# Altium schematic sheet rs232_part.SchDoc
size B
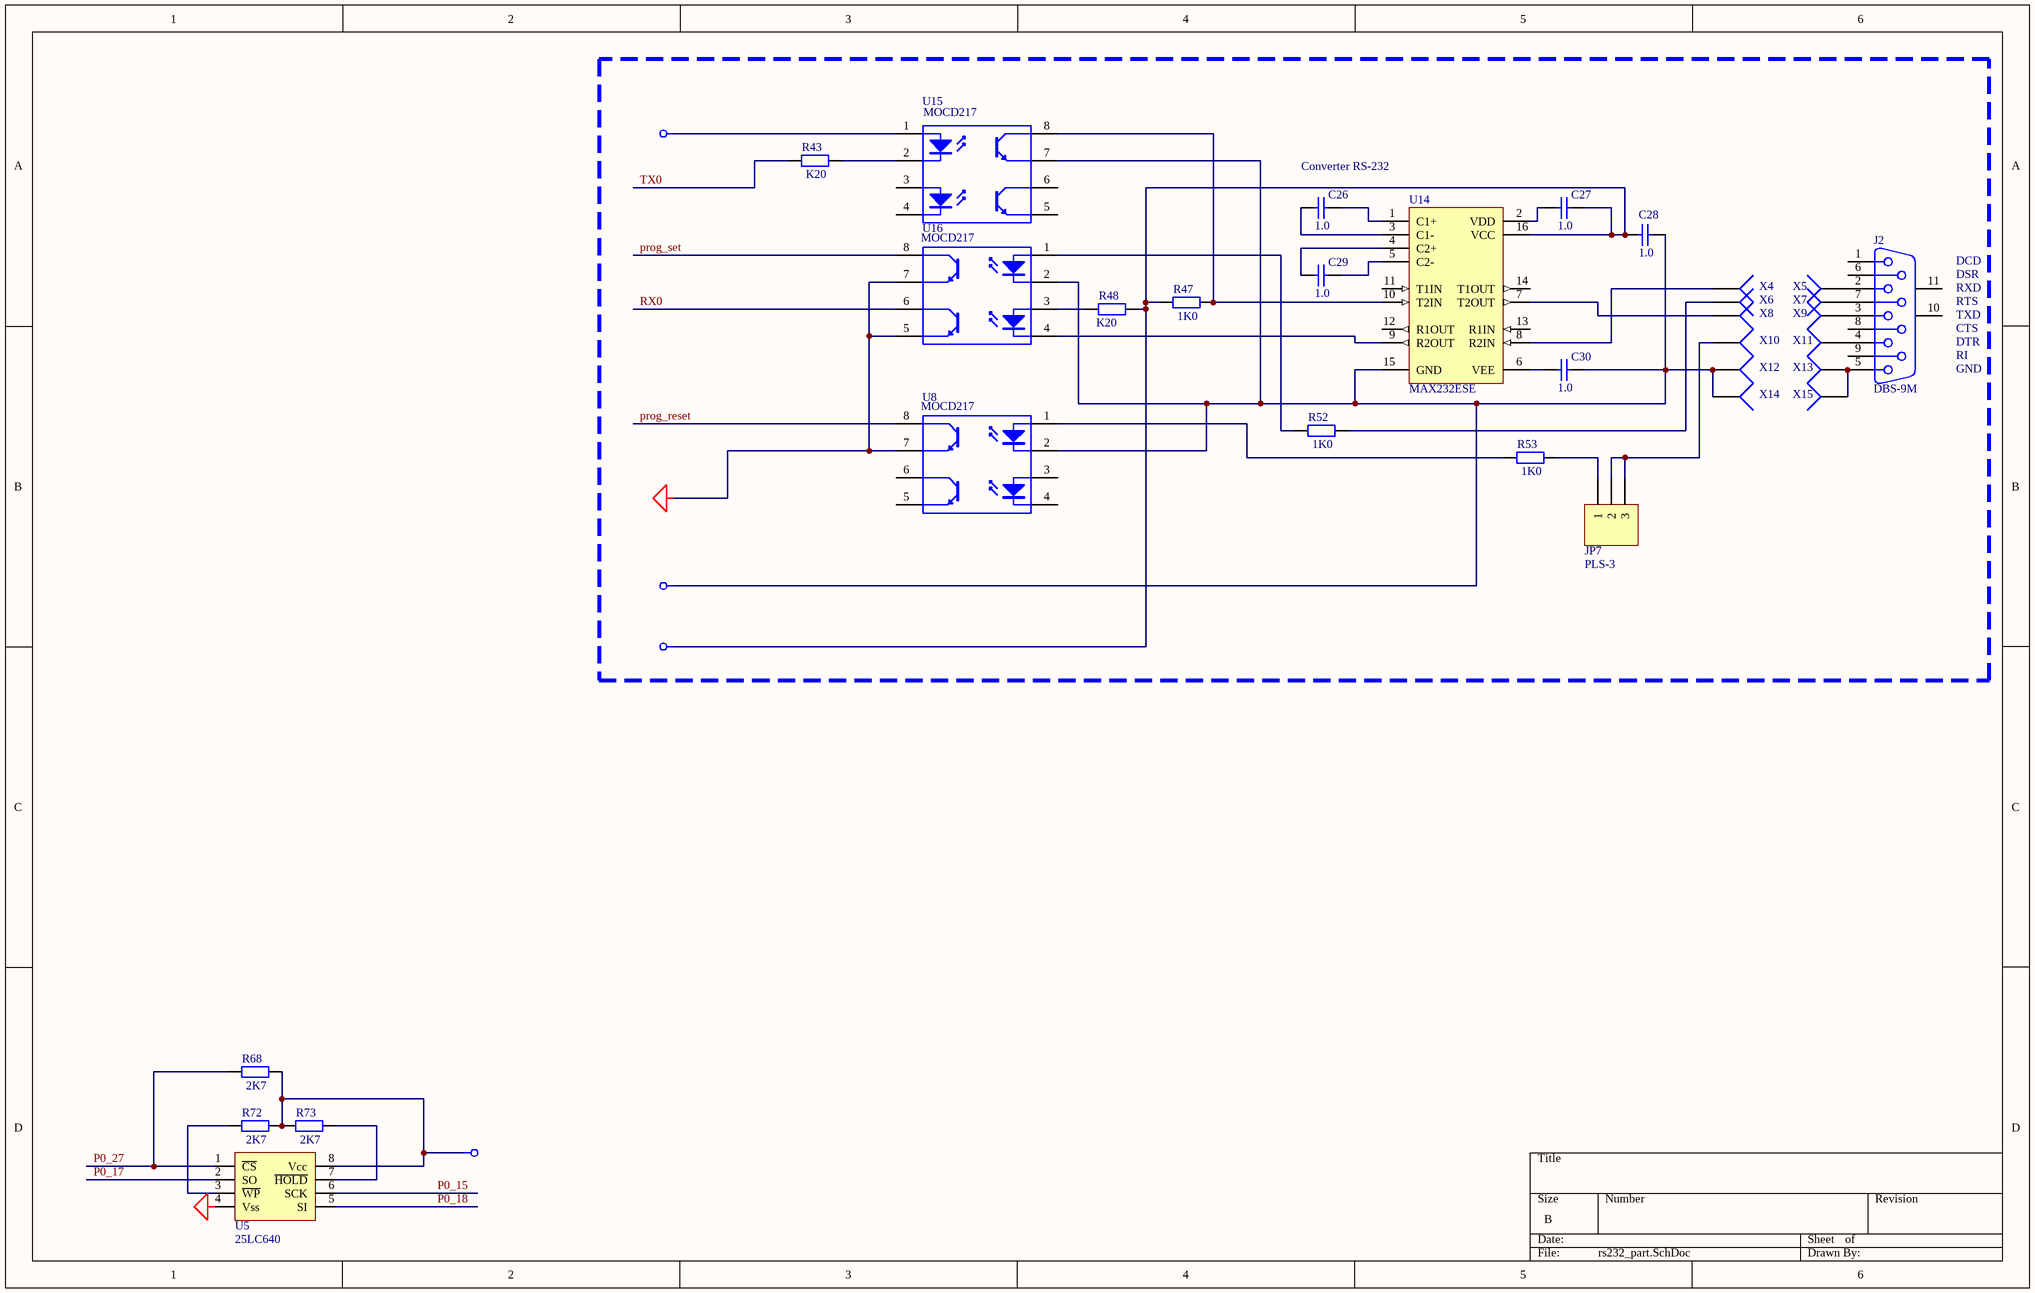
[diagram p0: rs232_part.SchDoc]

## Parts
C26  1.0  [C3216-1206]
C27  1.0  [_1206]
C28  1.0  [C3216-1206]
C29  1.0  [C3216-1206]
C30  1.0  [C3216-1206]
J2  DBS-9M  [DSUB_N9]
JP7  PLS-3  [HDR1X3]
R43  K20  [_1206]
R47  1K0  [_1206]
R48  K20  [_1206]
R52  1K0  [_1206]
R53  1K0  [_1206]
R68  2K7  [_1206]
R72  2K7  [_1206]
R73  2K7  [_1206]
U5  25LC640  [SO-G8/D5]
U8  MOCD217  [SO-G8]
U14  MAX232ESE  [SO-G16]
U15  MOCD217  [SO-G8]
U16  MOCD217  [SO-G8]
X4  (no value)  [PIN1]
X5  (no value)  [PIN1]
X6  (no value)  [PIN1]
X7  (no value)  [PIN1]
X8  (no value)  [PIN1]
X9  (no value)  [PIN1]
X10  (no value)  [PIN1]
X11  (no value)  [PIN1]
X12  (no value)  [PIN1]
X13  (no value)  [PIN1]
X14  (no value)  [PIN1]
X15  (no value)  [PIN1]

## Nets
+3v3: U15.1(A)
+5v: R68.2 R72.2 R73.1 U5.8(Vcc)
+5v_iz: C27.2 C28.1 R47.1 R48.2 U14.16(VCC)
-5v_iz: C28.2 C30.2 U8.2(K) U14.15(GND) U15.7(E) U16.2(K) X12.1 X14.1
GND: U5.4(Vss) U8.7(E) U16.5(E) U16.7(E)
P0_15: U5.6(SCK)
P0_17: U5.2(SO)
P0_18: U5.5(SI)
P0_27: R68.1 U5.1(~{CS})
prog_reset: U8.8(C)
prog_set: U16.8(C)
RX0: U16.6(C)
TX0: R43.1
NetC26_1: C26.1 U14.3(C1-)
NetC26_2: C26.2 U14.1(C1+)
NetC27_1: C27.1 U14.2(VDD)
NetC29_1: C29.1 U14.4(C2+)
NetC29_2: C29.2 U14.5(C2-)
NetC30_1: C30.1 U14.6(VEE)
NetJ2_2: J2.2 X5.1
NetJ2_3: J2.3 X9.1
NetJ2_4: J2.4 X11.1
NetJ2_5: J2.5 X13.1 X15.1
NetJ2_7: J2.7 X7.1
NetJP7_1: JP7.1 R53.2
NetJP7_2: JP7.2 JP7.3 X10.1
NetR43_2: R43.2 U15.2(K)
NetR47_2: R47.2 U14.10(T2IN) U15.8(C)
NetR48_1: R48.1 U16.3(A)
NetR52_1: R52.1 U16.1(A)
NetR52_2: R52.2 X6.1
NetR53_1: R53.1 U8.1(A)
NetR72_1: R72.1 U5.3(~{WP})
NetR73_2: R73.2 U5.7(~{HOLD})
NetU14_7: U14.7(T2OUT) X8.1
NetU14_8: U14.8(R2IN) X4.1
NetU14_9: U14.9(R2OUT) U16.4(K)

Not connected (* = marked no-connect by the designer): J2 1 6 8 9 10(MH1) 11(MH2); U8 3(A) 4(K) 5(E) 6(C); U14 11(T1IN) 12(R1OUT) 13(R1IN) 14(T1OUT); U15 3(A) 4(K) 5(E) 6(C)

## Notes on the sheet
- Converter RS-232
- (near J2) DCD
- (near J2) DSR
- (near J2) RXD
- (near J2) RTS
- (near J2) TXD
- (near J2) CTS
- (near J2) DTR
- (near J2) RI
- (near J2) GND

## Library data of the parts
C26-C30 = Cap Semi: Capacitor (Semiconductor SIM Model); Manufacturer: Generic Components; Class I: Passive; Value: 1,0; Published: 8-Jun-2000; Revision: July-2002: Re-released for DXP Platform.; Publisher: Altium Limited; Class II: Capacitor
J2 = D Connector 9: Receptacle Assembly, 9 Position, Right Angle; Manufacturer: Generic Components; Package Information: Latest Revision: O; Positions: 9; Published: 15-Jun-2001; Revision: July-2002: Re-released for DXP Platform.; Datasheet: (1-Sep-1999); Package Reference: 788750; Publisher: Altium Limited; Class I: Connector; Orientation: Right Angle; Gender: Receptacle
JP7 = Header 3: Header, 3-Pin; Manufacturer: Generic Components; Class I: Connector; Revision: July-2002: Re-released for DXP Platform.; Publisher: Altium Limited
R43 R48 = Res2: Resistor; Manufacturer: Generic Components; Class I: Passive; Value: 200R; Rule: Undefined; Published: 8-Jun-2000; Revision: July-2002: Re-released for DXP Platform.; Publisher: Altium Limited; Class II: Resistor
R47 R52 R53 R68 R72 R73 = Res2: Resistor; Manufacturer: Generic Components; Class I: Passive; Rule: Undefined; Published: 8-Jun-2000; Revision: July-2002: Re-released for DXP Platform.; Publisher: Altium Limited; Class II: Resistor
  R47 R52 R53: Value: 1K0
  R68 R72 R73: Value: 2K7
U14 = MAX232ESE: +5V Powered, Multi-Channel RS-232 Driver/Receiver; Manufacturer: Maxim; Class I: Communication; Class II: Transceiver; Published: 16-Jan-2001; Revision: July-2002: Re-released for DXP Platform.; Package Reference: NSO16; Publisher: Altium Limited
X4-X15 = Socket: Manufacturer: Generic Components; Class I: Connector; Revision: July-2002: Re-released for DXP Platform.; Publisher: Altium Limited